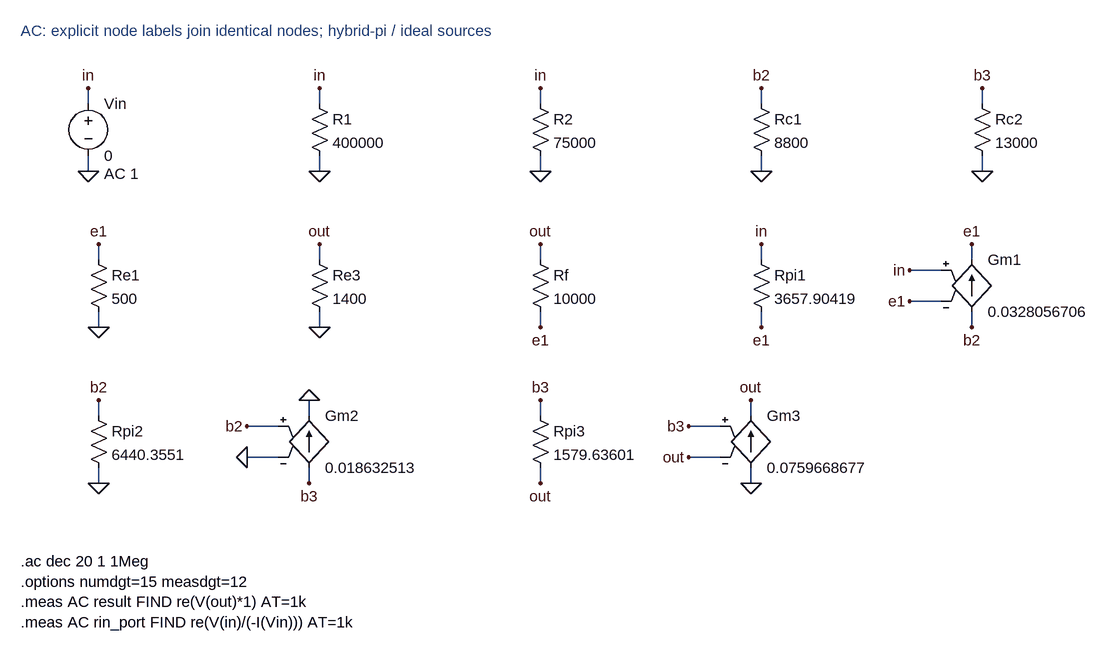
[diagram p0: schematic AC.asc]
AC.asc, the LTspice schematic file:
Version 4
SHEET 1 1800 1500
TEXT 16 -48 Left 2 ;AC: explicit node labels join identical nodes; hybrid-pi / ideal sources
WIRE 120 64 120 40
FLAG 120 40 in
WIRE 120 144 120 168
FLAG 120 168 0
SYMBOL voltage 120 48 R0
SYMATTR InstName Vin
WINDOW 123 24 124 Left 2
SYMATTR Value 0
SYMATTR Value2 AC 1
WIRE 476 64 476 40
FLAG 476 40 in
WIRE 476 144 476 168
FLAG 476 168 0
SYMBOL res 460 48 R0
SYMATTR InstName R1
SYMATTR Value 400000
WIRE 816 64 816 40
FLAG 816 40 in
WIRE 816 144 816 168
FLAG 816 168 0
SYMBOL res 800 48 R0
SYMATTR InstName R2
SYMATTR Value 75000
WIRE 1156 64 1156 40
FLAG 1156 40 b2
WIRE 1156 144 1156 168
FLAG 1156 168 0
SYMBOL res 1140 48 R0
SYMATTR InstName Rc1
SYMATTR Value 8800
WIRE 1496 64 1496 40
FLAG 1496 40 b3
WIRE 1496 144 1496 168
FLAG 1496 168 0
SYMBOL res 1480 48 R0
SYMATTR InstName Rc2
SYMATTR Value 13000
WIRE 136 304 136 280
FLAG 136 280 e1
WIRE 136 384 136 408
FLAG 136 408 0
SYMBOL res 120 288 R0
SYMATTR InstName Re1
SYMATTR Value 500
WIRE 476 304 476 280
FLAG 476 280 out
WIRE 476 384 476 408
FLAG 476 408 0
SYMBOL res 460 288 R0
SYMATTR InstName Re3
SYMATTR Value 1400
WIRE 816 304 816 280
FLAG 816 280 out
WIRE 816 384 816 408
FLAG 816 408 e1
SYMBOL res 800 288 R0
SYMATTR InstName Rf
SYMATTR Value 10000
WIRE 1156 304 1156 280
FLAG 1156 280 in
WIRE 1156 384 1156 408
FLAG 1156 408 e1
SYMBOL res 1140 288 R0
SYMATTR InstName Rpi1
SYMATTR Value 3657.90419
WIRE 1480 384 1480 408
FLAG 1480 408 b2
WIRE 1480 304 1480 280
FLAG 1480 280 e1
WIRE 1432 320 1384 320
FLAG 1384 320 in
WIRE 1432 368 1384 368
FLAG 1384 368 e1
SYMBOL g 1480 288 R0
SYMATTR InstName Gm1
SYMATTR Value 0.0328056706
WIRE 136 544 136 520
FLAG 136 520 b2
WIRE 136 624 136 648
FLAG 136 648 0
SYMBOL res 120 528 R0
SYMATTR InstName Rpi2
SYMATTR Value 6440.3551
WIRE 460 624 460 648
FLAG 460 648 b3
WIRE 460 544 460 520
FLAG 460 520 0
WIRE 412 560 364 560
FLAG 364 560 b2
WIRE 412 608 364 608
FLAG 364 608 0
SYMBOL g 460 528 R0
SYMATTR InstName Gm2
SYMATTR Value 0.018632513
WIRE 816 544 816 520
FLAG 816 520 b3
WIRE 816 624 816 648
FLAG 816 648 out
SYMBOL res 800 528 R0
SYMATTR InstName Rpi3
SYMATTR Value 1579.63601
WIRE 1140 624 1140 648
FLAG 1140 648 0
WIRE 1140 544 1140 520
FLAG 1140 520 out
WIRE 1092 560 1044 560
FLAG 1044 560 b3
WIRE 1092 608 1044 608
FLAG 1044 608 out
SYMBOL g 1140 528 R0
SYMATTR InstName Gm3
SYMATTR Value 0.0759668677
TEXT 16 768 Left 2 !.ac dec 20 1 1Meg\n.options numdgt=15 measdgt=12\n.meas AC result FIND re(V(out)*1) AT=1k\n.meas AC rin_port FIND re(V(in)/(-I(Vin))) AT=1k

The netlist it stands for:
* AC.asc
Vin in 0 0 AC 1
R1 in 0 400000
R2 in 0 75000
Rc1 b2 0 8800
Rc2 b3 0 13000
Re1 e1 0 500
Re3 out 0 1400
Rf out e1 10000
Rpi1 in e1 3657.90419
Gm1 b2 e1 in e1 0.0328056706
Rpi2 b2 0 6440.3551
Gm2 b3 0 b2 0 0.018632513
Rpi3 b3 out 1579.63601
Gm3 0 out b3 out 0.0759668677
* AC: explicit node labels join identical nodes; hybrid-pi / ideal sources
.ac dec 20 1 1Meg
.options numdgt=15 measdgt=12
.meas AC result FIND re(V(out)*1) AT=1k
.meas AC rin_port FIND re(V(in)/(-I(Vin))) AT=1k
.backanno
.end

* Results of the author's LTspice run, read from the files saved beside the schematic
* From the log:
*   result: re(V(out)*1)=(26.33163144dB,0°) at 1000
*   rin_port: re(V(in)/(-I(Vin)))=(95.8938491459dB,0°) at 1000